# Altium schematic sheet 2019-07-31_20-05-481.schdoc
size 518 x 147 mm; SheetNumber: 1; SheetTotal: 1
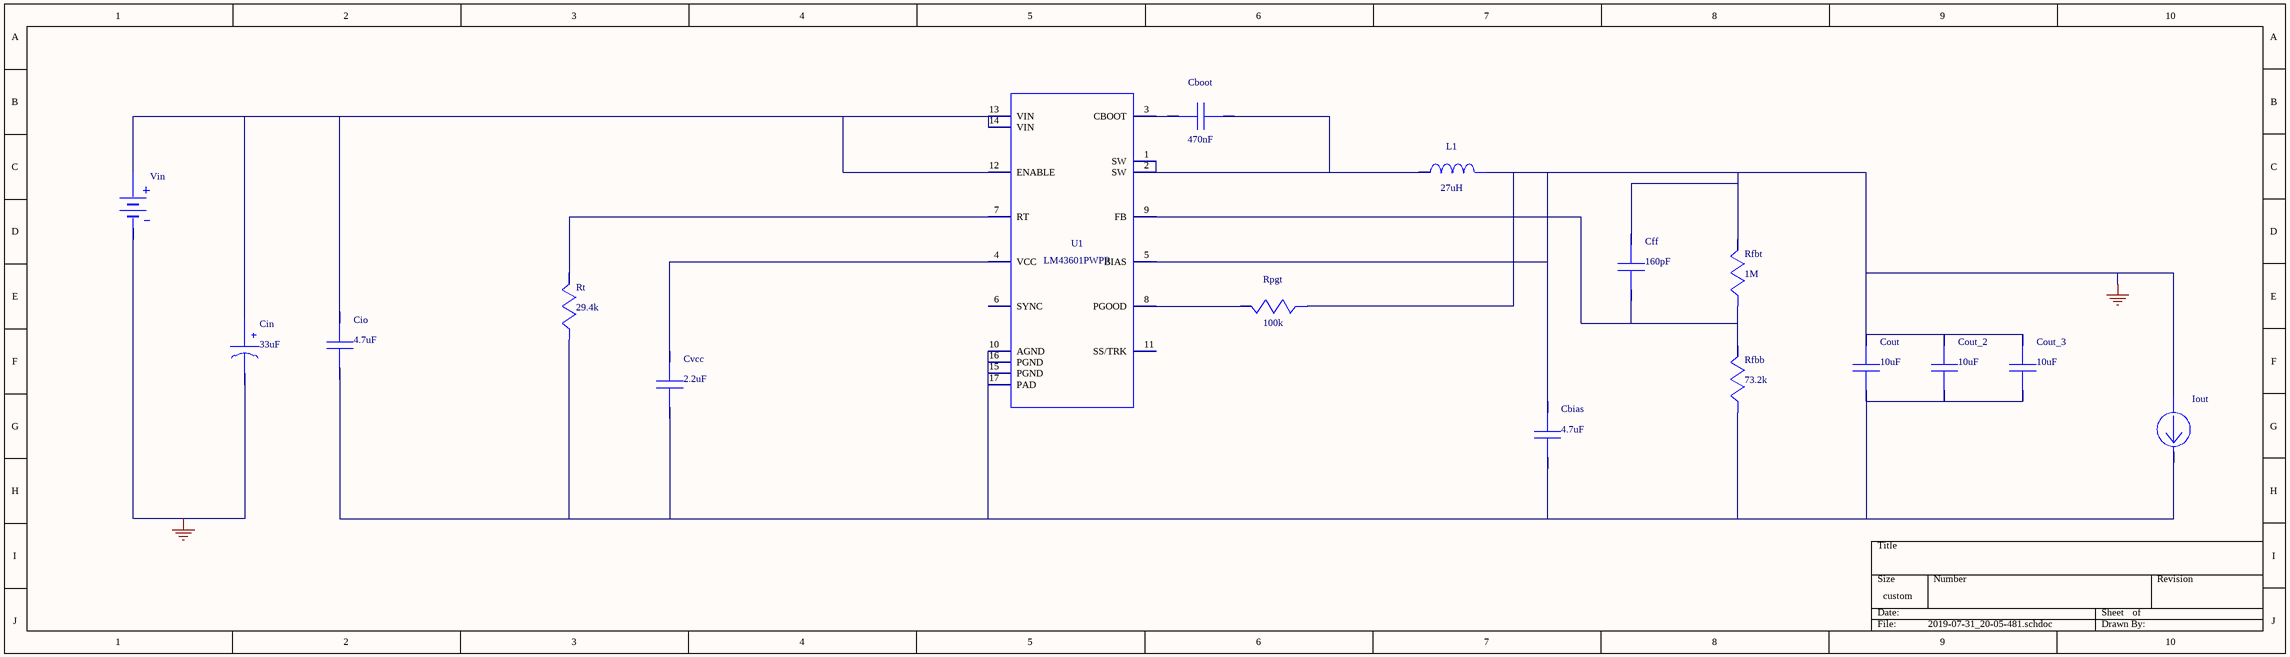
[diagram p0: 2019-07-31_20-05-481.schdoc]

## Parts
Cbias  value 4.7uF  (hidden comment: TMK212BJ475KG-T)
Cboot  value 470nF  (hidden comment: GRM155R60J474KE19D)
Cff  value 160pF  (hidden comment: GRM1555C1H161JA01D)
Cin  value 33uF  (hidden comment: EEE-FK1A330UR)
Cio  value 4.7uF  (hidden comment: C1608X5R1V475K080AC)
Cout  value 10uF  (hidden comment: CL32B106KBJNNWE)
Cout_2  value 10uF  (hidden comment: CL32B106KBJNNWE)
Cout_3  value 10uF  (hidden comment: CL32B106KBJNNWE)
Cvcc  value 2.2uF  (hidden comment: EMK212BJ225KG-T)
Iout  WB_CURRENT_LOAD  (value not drawn)
L1  value 27uH  (hidden comment: ME3220-273KLB)
Rfbb  value 73.2k  (hidden comment: CRCW040273K2FKED)
Rfbt  value 1M  (hidden comment: CRCW04021M00FKED)
Rpgt  value 100k  (hidden comment: CRCW0402100KFKED)
Rt  value 29.4k  (hidden comment: CRCW040229K4FKED)
U1  LM43603PWPR  (value not drawn)
Vin  WB_BATTERY  (value not drawn)

## Nets
0: Cbias.1 Cff.1 Cin.2(-) Cout.1 Cout_2.1 Cout_3.1 Iout.1(+) L1.2 Rfbt.1 Rpgt.2 U1.5(BIAS) Vin.2(-)
NetCbias_2: Cbias.2 Cio.2 Cout.2 Cout_2.2 Cout_3.2 Cvcc.2 Iout.2(-) Rfbb.2 Rt.2 U1.10(AGND) U1.15(PGND) U1.16(PGND) U1.17(PAD)
NetCboot_1: Cboot.1 L1.1 U1.1(SW) U1.2(SW)
NetCboot_2: Cboot.2 U1.3(CBOOT)
NetCff_2: Cff.2 Rfbb.1 Rfbt.2 U1.9(FB)
NetCin_1: Cin.1(+) Cio.1 U1.12(ENABLE) U1.13(VIN) U1.14(VIN) Vin.1(+)
NetCvcc_1: Cvcc.1 U1.4(VCC)
NetRpgt_1: Rpgt.1 U1.8(PGOOD)
NetRt_1: Rt.1 U1.7(RT)

Not connected (* = marked no-connect by the designer): U1 6(SYNC) 11(SS/TRK)

## Library data of the parts
Cbias = TMK212BJ475KG-T: Manufacturer Name: Taiyo Yuden; PackageReference: TMK212BJ475KG-T; Manufacturer Part Number: TMK212BJ475KG-T
Cboot = GRM155R60J474KE19D: GRM155R60J474KE1; Manufacturer Name: MuRata; PackageReference: GRM155R60J474KE19D; Manufacturer Part Number: GRM155R60J474KE19D
Cff = GRM1555C1H161JA01D: GRM1555C1H161JA0; Manufacturer Name: MuRata; PackageReference: GRM1555C1H161JA01D; Manufacturer Part Number: GRM1555C1H161JA01D
Cin = EEE-FK1A330UR: Manufacturer Name: Panasonic; PackageReference: EEE-FK1A330UR; Manufacturer Part Number: EEE-FK1A330UR
Cio = C1608X5R1V475K080AC: C1608X5R1V475K08; Manufacturer Name: TDK; PackageReference: C1608X5R1V475K080AC; Manufacturer Part Number: C1608X5R1V475K080AC
Cout Cout_2 Cout_3 = CL32B106KBJNNWE: Manufacturer Name: Samsung Electro-Mechanics; PackageReference: CL32B106KBJNNWE; Manufacturer Part Number: CL32B106KBJNNWE
Cvcc = EMK212BJ225KG-T: Manufacturer Name: Taiyo Yuden; PackageReference: EMK212BJ225KG-T; Manufacturer Part Number: EMK212BJ225KG-T
L1 = ME3220-273KLB: Manufacturer Name: Coilcraft; PackageReference: ME3220-273KLB; Manufacturer Part Number: ME3220-273KLB
Rfbb = CRCW040273K2FKED: Manufacturer Name: Vishay-Dale; PackageReference: CRCW040273K2FKED; Manufacturer Part Number: CRCW040273K2FKED
Rfbt = CRCW04021M00FKED: Manufacturer Name: Vishay-Dale; PackageReference: CRCW04021M00FKED; Manufacturer Part Number: CRCW04021M00FKED
Rpgt = CRCW0402100KFKED: Manufacturer Name: Vishay-Dale; PackageReference: CRCW0402100KFKED; Manufacturer Part Number: CRCW0402100KFKED
Rt = CRCW040229K4FKED: Manufacturer Name: Vishay-Dale; PackageReference: CRCW040229K4FKED; Manufacturer Part Number: CRCW040229K4FKED
U1 = LM43603PWPR: LM43601PWPR; Manufacturer Name: Texas Instruments; PackageReference: LM43601PWPR; Manufacturer Part Number: LM43603PWPR; Value: N/A
Iout = WB_CURRENT_LOAD: PackageReference: WB_CURRENT_LOAD; Manufacturer Part Number: WB_CURRENT_LOAD; Manufacturer Name: WB_CURRENT_LOAD; Value: N/A
Vin = WB_BATTERY: PackageReference: WB_BATTERY; Manufacturer Part Number: WB_BATTERY; Manufacturer Name: WB_BATTERY; Value: N/A